# Altium schematic sheet HR-Autoflat.SchDoc
size A4; Organization: Patrick Staden; Address1: V2I0; Address2: 04.05.2026; SheetNumber: 1; SheetTotal: 1
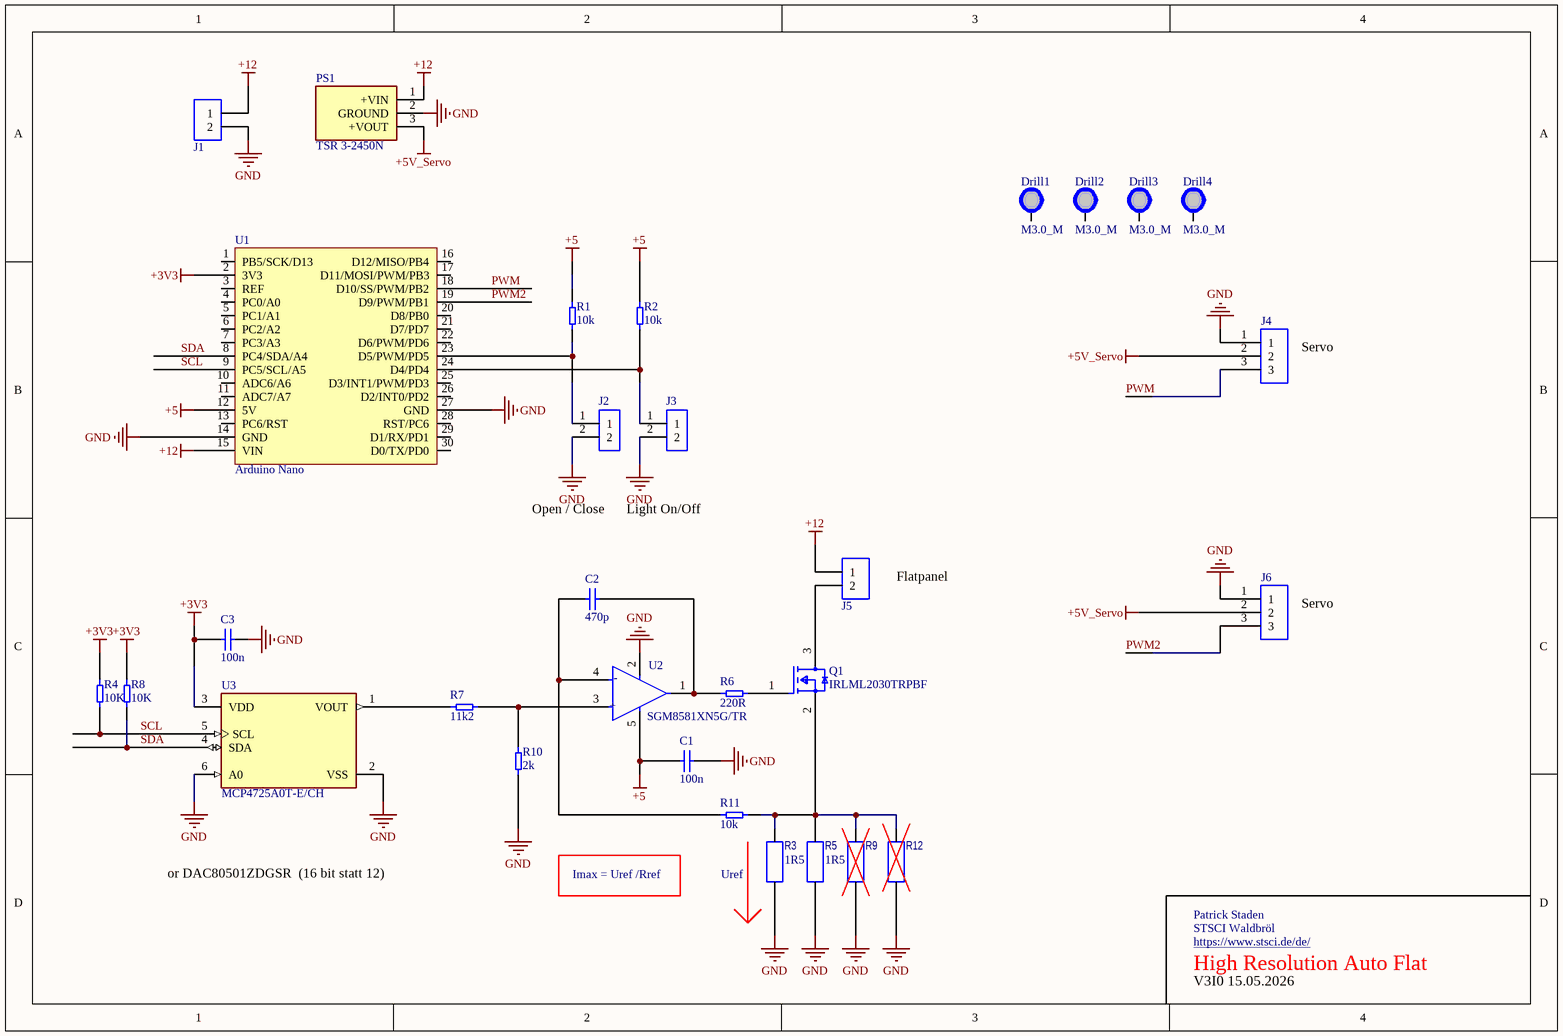
[diagram p0: HR-Autoflat.SchDoc]

## Parts
C1  100n  [C0603_L]
C2  470p  [C0603_L]
C3  100n  [C0603_L]
Drill1  M3.0_M  [M3.0_M]  (no BOM)
Drill2  M3.0_M  [M3.0_M]  (no BOM)
Drill3  M3.0_M  [M3.0_M]  (no BOM)
Drill4  M3.0_M  [M3.0_M]  (no BOM)
J1  PM_5.08_3_90_3.5_SW_-176052000  [MKDSN 5,08/2 2,5]  (value not drawn)
J2  896-7620  [2P Stiftleiste 2,54 mm]  (value not drawn)
J3  896-7620  [2P Stiftleiste 2,54 mm]  (value not drawn)
J4  251-8092  [3P Stiftleiste 2,54 mm]  (value not drawn)
J5  PM_5.08_3_90_3.5_SW_-176052000  [MKDSN 5,08/2 2,5]  (value not drawn)
J6  251-8092  [3P Stiftleiste 2,54 mm]  (value not drawn)
PS1  TSR 3-2450N  [TSR324120N]
Q1  IRLML2030TRPBF  [FP-Micro3-MFG]
R1  10k  [R0603_M]
R2  10k  [R0603_M]
R3  1R5  [R 0.125W V P2.54]
R4  10K  [R0805_M]
R5  1R5  [R 0.125W V P2.54]
R6  220R  [R0603_M]
R7  11k2  [R0603_M]
R8  10K  [R0805_M]
R9  1R4  [R 0.125W V P2.54]  (value not drawn)
R10  2k  [R0603_M]
R11  10k  [R0603_M]
R12  1R4  [R 0.125W V P2.54]  (value not drawn)
U1  Arduino Nano  [Arduino Nano]
U2  SGM8581XN5G/TR  [FP-C04-091-OT-MFG]
U3  MCP4725A0T-E/CH  [FP-C04-028-CHY-IPC_A]

## Nets
+3V3: C3.1 R4.2 R8.2 U1.2(3V3) U3.3(VDD)
+5: C1.1 R1.2 R2.2 U1.12(5V) U2.5(VDD)
+5V_Servo: J4.2 J6.2 PS1.3(+VOUT)
+12: J1.1 J5.1 PS1.1(+VIN) U1.15(VIN)
GND: C1.2 C3.2 J1.2 J2.2 J3.2 J4.1 J6.1 PS1.2(GROUND) R3.1 R5.1 R9.1 R10.1 R12.1 U1.14(GND) U1.27(GND) U2.2(VSS) U3.2(VSS) U3.6(A0)
PWM: J4.3 U1.18(D10/SS/PWM/PB2)
PWM2: J6.3 U1.19(D9/PWM/PB1)
SCL: R4.1 U1.9(PC5/SCL/A5) U3.5(SCL)
SDA: R8.1 U1.8(PC4/SDA/A4) U3.4(SDA)
NetC2_1: C2.1 R11.1 U2.4(VIN-)
NetC2_2: C2.2 R6.1 U2.1(VOUT)
NetJ2_1: J2.1 R1.1 U1.23(D5/PWM/PD5)
NetJ3_1: J3.1 R2.1 U1.24(D4/PD4)
NetJ5_2: J5.2 Q1.3(D)
NetQ1_1: Q1.1(G) R6.2
NetQ1_2: Q1.2(S) R3.2 R5.2 R9.2 R11.2 R12.2
NetR7_1: R7.1 U3.1(VOUT)
NetR7_2: R7.2 R10.2 U2.3(VIN+)

Not connected (* = marked no-connect by the designer): Drill1 1; Drill2 1; Drill3 1; Drill4 1; U1 1(PB5/SCK/D13) 3(REF) 4(PC0/A0) 5(PC1/A1) 6(PC2/A2) 7(PC3/A3) 10(ADC6/A6) 11(ADC7/A7) 13(PC6/RST) 16(D12/MISO/PB4) 17(D11/MOSI/PWM/PB3) 20(D8/PB0) 21(D7/PD7) 22(D6/PWM/PD6) 25(D3/INT1/PWM/PD3) 26(D2/INT0/PD2) 28(RST/PC6) 29(D1/RX/PD1) 30(D0/TX/PD0)

## Notes on the sheet
- (near J4) Servo
- Open / Close
- Light On/Off
- Flatpanel
- (near J6) Servo
- or DAC80501ZDGSR  (16 bit statt 12)
- Imax = Uref /Rref
- (near R3) Uref
- Patrick Staden
- STSCI Waldbröl
- https://www.stsci.de/de/
- High Resolution Auto Flat
- V3I0 15.05.2026
- Title
- Size:
- Date:
- A4
- Number:
- Time:
- Revision:
- Sheet
- of
- File:
- (in symbol SOT-23-5) -; +

## Library data of the parts
C1-C3 = C0603: .CHECKED PCB: RF; Published: 8-Jun-2000; LatestRevisionDate: 29-May-2009; LatestRevisionNote: IPC-7351 Footprint Added.; PackageReference: C1206; Publisher: Altium Limited; PackageDescription: Chip Capacitor; .CHECKED SCH: RF
Drill1-Drill4 = Drill: .CHECKED PCB: RF; .CHECKED SCH: RF
J1 J5 = MKDSN 5,08/2 2,5: 间距5.08mm 2pin 10A 300V 可拼接 螺钉式 直插 配线24-14AWG(0.2-2.5)mm²; Manufacturer: Phoenix Contact; Manufacturer Part Number: 1888687; .CHECKED PCB: PS; Current Rating: 16A; Number of Contacts: 2; Voltage Rating: 400V; Number of Levels: 1; Connector Type: Screw; Max Supply Voltage: 250V; Gender: Male; Wire Gauge (Max): 30AWG; Wire Gauge (Min): 12AWG; Wire/Cable Gauge: 24AWG; Pitch: 5.08mm; Approvals: UL,VDE,cULus,CB,EAC; .CHECKED SCH: PS; Supplier 1: RSComponents; Supplier Part Number 1: 8045095; RoHS: Yes; Category: Terminal Blocks; Stock 1: 462; Mount: Through Hole; Number of Pins: 2; Housing Material: Polyamide; Contact Material: Tin; Color: Green; Weight: 0.114993oz; Material: Polyamide; Housing Color: Green; Termination: Screw; Packaging: Bulk; Package Quantity: 50; Orientation: Straight; Number of Rows: 1; Max Current Rating: 16A; Number of Positions Per Level: 2; Current: 10A; Voltage: 300V; Series: COMBICON MKDSN; Number of Positions: 2; Number of Circuits: 2; Number of Poles: 2; Length: 11.6mm; Width: 9.5mm; Height: 10.16mm; Depth: 9.5mm; REACH SVHC: Unknown; RoHS Compliant: Yes; Lead Free: Lead Free; Flammability Rating: UL94 V-0; ComponentLink1URL: https://datasheet.ciiva.com/5765/528137-5765413.pdf?src-supplier=Farnell; ComponentLink1Description: https://datasheet.ciiva.com/5765/528137-5765413.pdf?src-supplier=Farnell; ComponentLink2URL: https://datasheet.ciiva.com/16047/1888687-16047138.pdf?src-supplier=Onlinecomponents.com; ComponentLink2Description: https://datasheet.ciiva.com/16047/1888687-16047138.pdf?src-supplier=Onlinecomponents.com; ComponentLink3URL: https://datasheet.ciiva.com/6751/1888687-6751366.pdf?src-supplier=Digi-Key; ComponentLink3Description: https://datasheet.ciiva.com/6751/1888687-6751366.pdf?src-supplier=Digi-Key; ComponentLink4URL: https://datasheet.ciiva.com/29226/774087-da-01-en-printklemme-1888687-250-st-29226666.pdf?src-supplier=Conrad; ComponentLink4Description: https://datasheet.ciiva.com/29226/774087-da-01-en-printklemme-1888687-250-st-29226666.pdf?src-supplier=Conrad; Supplier 2: Farnell; Supplier Part Number 2: 1792766
J2 J3 = 2P Stiftleiste 2,54: 7 Pin Stiftleiste Raster 2,54 mm / 2.54mm Pitch 7 Way 1 Row Straight PCB Header, Solder Termination / RS Nr.: 896-7620; Manufacturer_Name: Molex; Manufacturer_Part_Number: 42375-0002; Geometry.Height: 8.69mm; .CHECKED PCB: RF; RS Part Number: 896-7620; Datasheet Link: https://componentsearchengine.com/Datasheets/3/61300711121.pdf; .CHECKED SCH: RF
J4 J6 = 3P Stiftleiste 2,54: 3 Pin Stiftleiste Raster 2,54 mm / Wurth Elektronik WR-PHD Series, Series Number 6130, 2.54mm Pitch 7 Way 1 Row Straight PCB Header, Solder Termination / RS Nr.: 61300711121; Geometry.Height: 8.69mm; .CHECKED PCB: RF; RS Part Number: 251-8092; Manufacturer_Name: RS; Manufacturer_Part_Number: 251-8092; Datasheet Link: https://docs-emea.rs-online.com/webdocs/1584/0900766b81584a98.pdf; .CHECKED SCH: RF
PS1 = TSR_3-24120N: or TSR 3-2450N; Manufacturer_Name: Traco Power; Datasheet Link: https://tracopower.com/tsr3n-datasheet/; Height: 10.7mm; Manufacturer_Part_Number: TSR 3-2450N; Mouser Part Number: TSR 3-2450N; Mouser Price/Stock: https://www.mouser.co.uk/ProductDetail/TRACO-Power/TSR-3-24120N?qs=7%2F6SraaimPQ2uf1LtAOePA%3D%3D
Q1 = CMP-32901-000110-1: MOSFET N-CH 30V 2.7A SOT-23-3; Manufacturer: Infineon; Depletion Mode: False; Threshold Vgs Min: 1.3V; Number Of N Channels: 1; Turn Off Delay Time: 4.5ns; Gate To Source Voltage: 20V; Turn On Delay Time: 4.1ns; Max Forward Diode Voltage: 1V; Standoff Height: 0.01mm; Drain To Source Resistance: 123mΩ; Input Capacitace At Vds: 110pF @ 15V; Threshold Vgs Max: 2.3V; Gate Charge At Vgs: 1nC @ 4.5V; Power Dissipation: 1.3W; Reverse Recovery Charge: 0.3nC; Rthja Max: 100°C/W; Max Junction Temp: +150°C; Reverse Recovery Time: 9ns; Pulse Drain Current: 11A; Manufacturer Part Number: IRLML2030TRPBF; Temperature: -55°C to +150°C; Octopart: https://octopart.com/irlml2030trpbf-infineon-65874966; Height: 1.12mm; Device Class L3: MOSFETs; Lead Free: Yes; Temperature Range Low: -55°C; Footprint Url: http://www.irf.com/package/outline/po_micro3.pdf; RoHS: TRUE; Automotive: No; Device Class L1: Discrete Semiconductors; ComponentLink2URL: https://www.infineon.com/dgdl/irlml2030pbf.pdf?fileId=5546d462533600a401535664aef525ec; Number Of Channels: 1; ComponentLink2Description: Datasheet; Category: Trans; Continuous Drain Current: 2.7A; Device Class L2: Transistors; Drain To Source Voltage: 30V; Drain To Source Breakdown Voltage: 30V; Temperature Range High: +150°C; Digikey Description: MOSFET N-CH 30V 2.7A SOT-23-3; Package: Micro3; Ipc Land Pattern Name: SOT95P237X100-3
R1 R2 R6 R7 R10 R11 = R0603: Manufacture: Bourns; Manufacture Nr: PWR263S-35-7R50F; Power: 35 W; Gehäuse: T0-263; Value: 7,5 Ohm; .CHECKED PCB: RF; Published: 8-Jun-2000; LatestRevisionDate: 17-Jul-2002; LatestRevisionNote: Re-released for DXP Platform.; PackageReference: AXIAL-0.3; Publisher: Altium Limited; PackageDescription: Axial Device, Thru-Hole; 2 Leads; 0.3 in Pin Spacing; Distributor: RS; Distributor Nr: 733-2688; Datasheet: https://docs-emea.rs-online.com/webdocs/0f73/0900766b80f73c76.pdf; .CHECKED SCH: RF
R3 R5 = Resistor RU: Ind Power 180uH 10% 1KHz Ferrite 380mA Axial T/R; Manufacturer: Abracon; Manufacturer Part Number: AIAP-01-181K-T; VALUE: 1R4; DC Resistance (DCR): 1.4Ω; Lead Diameter: 510µm; Lead Length: 29.2mm; Number of Circuits: 1; Self Resonant Frequency: 2.8MHz; Shielding: Unshielded; Supplier 1: Avnet; Supplier Part Number 1: AIAP-01-181K-T; RoHS: Compliant; Category: Fixed Inductors; Case/Package: Axial; China RoHS: Compliant; Composition: Wirewound; Core Material: Ferrite; Current Rating: 380mA; Diameter: 3.3mm; Export Control Classification Number (ECCN) Code: EAR99; Height: 9.14mm; Harmonized Tariff Schedule (HTS) Code: 8504.50.80.00; Introduction Date: 2012-02-21; Lead/Base Style: Axial; Length: 9.14mm; Lifecycle Status: Production; Max Current Rating: 380mA; Max DC Current: 380mA; Max Operating Temperature: 105°C; Min Operating Temperature: -40°C; Mounting Technology: Through Hole; Number of Terminals: 2; Radiation Hardening: No; REACH SVHC: Yes; Termination: Axial; Test Frequency: 1kHz; Tolerance: 10%; ComponentLink1URL: https://datasheet.octopart.com:443/AIAP-01-181K-T-Abracon-datasheet-141159919.pdf?src-supplier=IHS; ComponentLink1Description: https://datasheet.octopart.com:443/AIAP-01-181K-T-Abracon-datasheet-141159919.pdf?src-supplier=IHS; ComponentLink2URL: https://sigma.octopart.com:443/141160011/technical_drawing/Abracon-AIAP-01-181K-T.pdf?src-supplier=Abracon+SCT; ComponentLink2Description: https://sigma.octopart.com:443/141160011/technical_drawing/Abracon-AIAP-01-181K-T.pdf?src-supplier=Abracon+SCT; ComponentLink3URL: https://datasheet.octopart.com:443/AIAP-01-181K-T-Abracon-datasheet-520064.pdf?src-supplier=Sager+Electronics; ComponentLink3Description: https://datasheet.octopart.com:443/AIAP-01-181K-T-Abracon-datasheet-520064.pdf?src-supplier=Sager+Electronics; ComponentLink4URL: http://sigma.octopart.com:80/conflict_mineral_statement/Abracon-company-27.pdf?src-supplier=Compliance+Statements; ComponentLink4Description: http://sigma.octopart.com:80/conflict_mineral_statement/Abracon-company-27.pdf?src-supplier=Compliance+Statements
R4 R8 = R0805: Manufacture: Bourns; Manufacture Nr: PWR263S-35-7R50F; Power: 35 W; Gehäuse: T0-263; Value: 7,5 Ohm; .CHECKED PCB: RF; Published: 8-Jun-2000; LatestRevisionDate: 17-Jul-2002; LatestRevisionNote: Re-released for DXP Platform.; PackageReference: AXIAL-0.3; Publisher: Altium Limited; PackageDescription: Axial Device, Thru-Hole; 2 Leads; 0.3 in Pin Spacing; Distributor: RS; Distributor Nr: 733-2688; Datasheet: https://docs-emea.rs-online.com/webdocs/0f73/0900766b80f73c76.pdf; .CHECKED SCH: RF
R9 R12 = Resistor RU: Ind Power 180uH 10% 1KHz Ferrite 380mA Axial T/R; Manufacturer: Abracon; Manufacturer Part Number: AIAP-01-181K-T; DC Resistance (DCR): 1.4Ω; Lead Diameter: 510µm; Lead Length: 29.2mm; Number of Circuits: 1; Self Resonant Frequency: 2.8MHz; Shielding: Unshielded; VALUE: 1R4; Supplier 1: Avnet; Supplier Part Number 1: AIAP-01-181K-T; RoHS: Compliant; Category: Fixed Inductors; Case/Package: Axial; China RoHS: Compliant; Composition: Wirewound; Core Material: Ferrite; Current Rating: 380mA; Diameter: 3.3mm; Export Control Classification Number (ECCN) Code: EAR99; Height: 9.14mm; Harmonized Tariff Schedule (HTS) Code: 8504.50.80.00; Introduction Date: 2012-02-21; Lead/Base Style: Axial; Length: 9.14mm; Lifecycle Status: Production; Max Current Rating: 380mA; Max DC Current: 380mA; Max Operating Temperature: 105°C; Min Operating Temperature: -40°C; Mounting Technology: Through Hole; Number of Terminals: 2; Radiation Hardening: No; REACH SVHC: Yes; Termination: Axial; Test Frequency: 1kHz; Tolerance: 10%; ComponentLink1URL: https://datasheet.octopart.com:443/AIAP-01-181K-T-Abracon-datasheet-141159919.pdf?src-supplier=IHS; ComponentLink1Description: https://datasheet.octopart.com:443/AIAP-01-181K-T-Abracon-datasheet-141159919.pdf?src-supplier=IHS; ComponentLink2URL: https://sigma.octopart.com:443/141160011/technical_drawing/Abracon-AIAP-01-181K-T.pdf?src-supplier=Abracon+SCT; ComponentLink2Description: https://sigma.octopart.com:443/141160011/technical_drawing/Abracon-AIAP-01-181K-T.pdf?src-supplier=Abracon+SCT; ComponentLink3URL: https://datasheet.octopart.com:443/AIAP-01-181K-T-Abracon-datasheet-520064.pdf?src-supplier=Sager+Electronics; ComponentLink3Description: https://datasheet.octopart.com:443/AIAP-01-181K-T-Abracon-datasheet-520064.pdf?src-supplier=Sager+Electronics; ComponentLink4URL: http://sigma.octopart.com:80/conflict_mineral_statement/Abracon-company-27.pdf?src-supplier=Compliance+Statements; ComponentLink4Description: http://sigma.octopart.com:80/conflict_mineral_statement/Abracon-company-27.pdf?src-supplier=Compliance+Statements
U1 = Arduino Nano: Nano Every Development Brd, 8Bit Avr Mcu Rohs Compliant: Yes; Manufacturer Part Number: ABX00028; .SCH Checked: PS; Supplier 1: Digi-Key; Supplier Part Number 1: 1050-ABX00028-ND; Manufacturer: Arduino; RoHS: No; Category: Embedded Processors and Controllers; Stock 1: 489; .PCB Checked: PS
U2 = SOT-23-5: Number of Channels: 1; Lifecycle Status: Production
U3 = CMP-0188-00760-3: IC DAC 12BIT V-OUT SOT23-6; Number of Outputs: 1; Supply Type: Single; Integral Nonlinearity (INL): 14.5LSB; Polarity: Unipolar; Number of Bits: 12; Min Supply Voltage: 2.7V; Output Type: Voltage; Settling Time: 6us; Max Supply Voltage: 5.5V; Nominal Supply Current: 210uA; Resolution: 12b; Interface: I2C; Input Offset Voltage (Vos): 1.1mV; Radiation Hardening: No; Number of DAC Channels: 1; Length: 3.1mm; Number of D/A Converters: 1; Number of Pins: 6; Case/Package: SOT-23-6; Lead Free: Lead Free; Number of Channels: 1; Termination: SMD/SMT; Width: 1.8mm; Contact Plating: Tin; Package Quantity: 3000; Max Operating Temperature: 125°C; Min Operating Temperature: -40°C; REACH SVHC: No SVHC; Mount: Surface Mount; Height: 1.3mm; Packaging: Tape and Reel; Number of Converters: 1